# Altium schematic sheet 澳帝T6智能坐便器遥控板.SchDoc
size A3
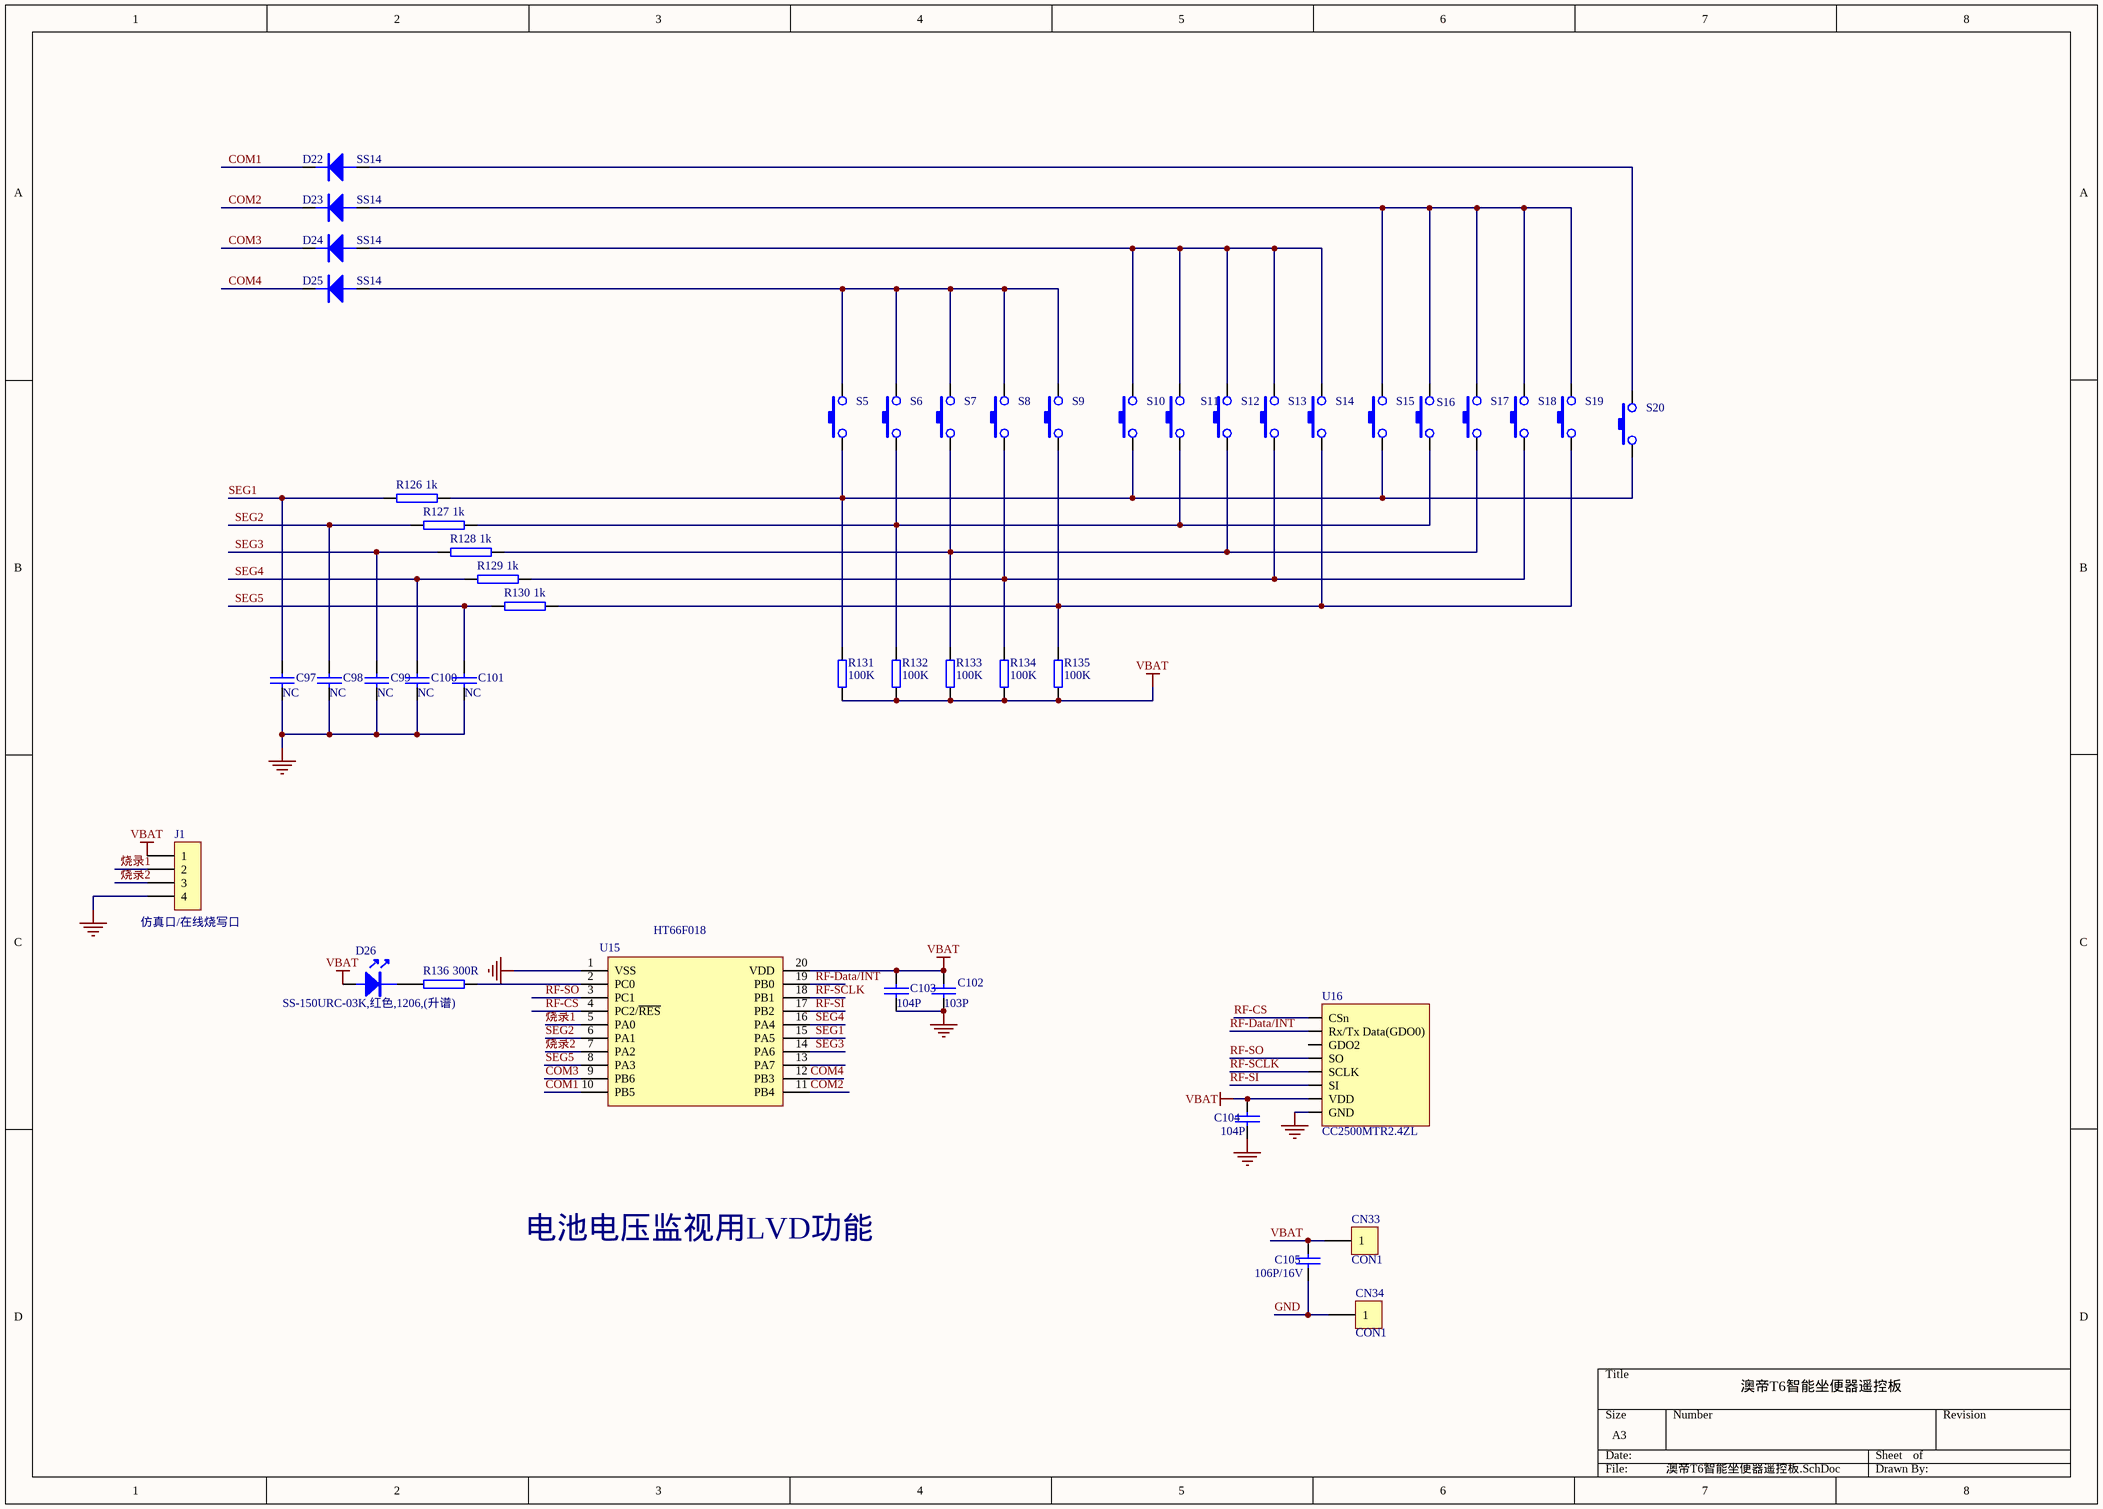
[diagram p0: 澳帝T6智能坐便器遥控板.SchDoc]

## Parts
C97  NC  [C0805-T]
C98  NC  [C0805-T]
C99  NC  [C0805-T]
C100  NC  [C0805-T]
C101  NC  [C0805-T]
C102  103P  [C0805-T]
C103  104P  [C0805-T]
C104  104P  [C0805-T]
C105  106P/16V  [C0805-T]
CN33  CON1  [_TESTPIONT]
CN34  CON1  [_TESTPIONT]
D22  SS14  [D-SMA-T]
D23  SS14  [D-SMA-T]
D24  SS14  [D-SMA-T]
D25  SS14  [D-SMA-T]
D26  SS-150URC-03K,红色,1206,(升谱)  [LED-1206-T]
J1  仿真口/在线烧写口  [PZ-1*4-M-SI]
R126  1k  [R0805-T]
R127  1k  [R0805-T]
R128  1k  [R0805-T]
R129  1k  [R0805-T]
R130  1k  [R0805-T]
R131  100K  [R0805-T]
R132  100K  [R0805-T]
R133  100K  [R0805-T]
R134  100K  [R0805-T]
R135  100K  [R0805-T]
R136  300R  [R0805-T]
S5  水压、暖风-  [KG6*6]  (value not drawn)
S6  6*6*5  [KG6*6]  (value not drawn)
S7  座温调节  [KG6*6]  (value not drawn)
S8  座温调节  [KG6*6]  (value not drawn)
S9  座温调节  [KG6*6]  (value not drawn)
S10  座温调节  [KG6*6]  (value not drawn)
S11  座温调节  [KG6*6]  (value not drawn)
S12  座温调节  [KG6*6]  (value not drawn)
S13  座温调节  [KG6*6]  (value not drawn)
S14  座温调节  [KG6*6]  (value not drawn)
S15  座温调节  [KG6*6]  (value not drawn)
S16  座温调节  [KG6*6]  (value not drawn)
S17  座温调节  [KG6*6]  (value not drawn)
S18  座温调节  [KG6*6]  (value not drawn)
S19  座温调节  [KG6*6]  (value not drawn)
S20  座温调节  [KG6*6]  (value not drawn)
U15  HT66F018  [SOP20-7.6-1.27]
U16  CC2500MTR2.4ZL  [CC2500MTR2.4ZL]

## Nets
GND: C97.2 C98.2 C99.2 C100.2 C101.2 C102.2 C103.2 C104.2 C105.2 CN34.1 J1.4 U15.1(VSS) U16.1(GND)
VBAT: C102.1 C103.1 C104.1 C105.1 CN33.1 D26.A J1.1 R131.2 R132.2 R133.2 R134.2 R135.2 U15.20(VDD) U16.2(VDD)
COM1: D22.K U15.10(PB5)
COM2: D23.K U15.11(PB4)
COM3: D24.K U15.9(PB6)
COM4: D25.K U15.12(PB3)
RF-CS: U15.4(PC2/~{RES}) U16.8(CSn)
RF-Data/INT: U15.19(PB0) U16.7(Rx/Tx_Data(GDO0))
RF-SCLK: U15.18(PB1) U16.4(SCLK)
RF-SI: U15.17(PB2) U16.3(SI)
RF-SO: U15.3(PC1) U16.5(SO)
SEG1: C97.1 R126.1 U15.15(PA5)
SEG2: C98.1 R127.1 U15.6(PA1)
SEG3: C99.1 R128.1 U15.14(PA6)
SEG4: C100.1 R129.1 U15.16(PA4)
SEG5: C101.1 R130.1 U15.8(PA3)
烧录1: J1.2 U15.5(PA0)
烧录2: J1.3 U15.7(PA2)
NetD22_A: D22.A S20.2
NetD23_A: D23.A S15.2 S16.2 S17.2 S18.2 S19.2
NetD24_A: D24.A S10.2 S11.2 S12.2 S13.2 S14.2
NetD25_A: D25.A S5.2 S6.2 S7.2 S8.2 S9.2
NetD26_K: D26.K R136.1
NetR126_2: R126.2 R131.1 S5.1 S10.1 S15.1 S20.1
NetR127_2: R127.2 R132.1 S6.1 S11.1 S16.1
NetR128_2: R128.2 R133.1 S7.1 S12.1 S17.1
NetR129_2: R129.2 R134.1 S8.1 S13.1 S18.1
NetR130_2: R130.2 R135.1 S9.1 S14.1 S19.1
NetR136_2: R136.2 U15.2(PC0)

Not connected (* = marked no-connect by the designer): U15 13(PA7); U16 6(GDO2)

## Notes on the sheet
- 电池电压监视用LVD功能
- 澳帝T6智能坐便器遥控板

## Library data of the parts
C97-C105 = CAP: Capacitor
CN33 CN34 = CON1: Connector
D22-D25 = DIODE
D26 = LED
J1 = CON4: Connector
R126-R136 = RES2
S5-S20 = SW-PB
U15 = HT66F004
U16 = 2.4GRF